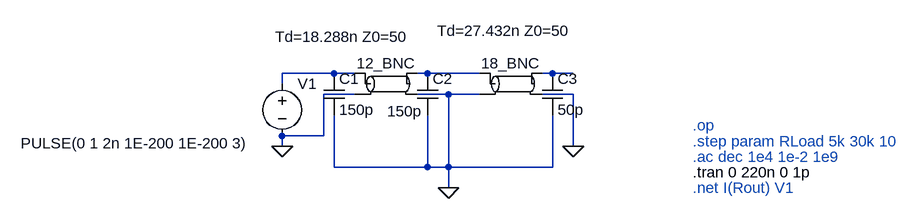
[diagram p0: schematic 2a matched.asc]
2a matched.asc, the LTspice schematic file:
Version 4.1
SHEET 1 1168 680
WIRE 272 432 192 432
WIRE 304 432 272 432
WIRE 416 432 400 432
WIRE 496 432 416 432
WIRE 608 432 592 432
WIRE 640 432 608 432
WIRE 192 448 192 432
WIRE 304 464 256 464
WIRE 448 464 400 464
WIRE 496 464 448 464
WIRE 640 464 592 464
WIRE 256 528 256 464
WIRE 256 528 192 528
WIRE 192 544 192 528
WIRE 640 544 640 464
WIRE 272 576 272 496
WIRE 416 576 416 496
WIRE 416 576 272 576
WIRE 448 576 448 464
WIRE 448 576 416 576
WIRE 608 576 608 496
WIRE 608 576 448 576
WIRE 448 608 448 576
FLAG 448 608 0
FLAG 192 544 0
FLAG 640 544 0
SYMBOL tline 352 448 R0
WINDOW 3 -67 -88 Top 2
SYMATTR InstName 12_BNC
SYMATTR Value Td=18.288n Z0=50
SYMBOL Voltage 192 432 R0
WINDOW 3 -402 107 Left 2
SYMATTR Value PULSE(0 1 2n 1E-200 1E-200 3)
SYMATTR InstName V1
SYMATTR SpiceLine Rser=50
SYMBOL tline 544 448 R0
WINDOW 3 -10 -97 Top 2
SYMATTR InstName 18_BNC
SYMATTR Value Td=27.432n Z0=50
SYMBOL cap 256 432 R0
SYMATTR InstName C1
SYMATTR Value 150p
SYMBOL cap 400 432 R0
WINDOW 3 -46 58 Left 2
SYMATTR InstName C2
SYMATTR Value 150p
SYMBOL cap 592 432 R0
SYMATTR InstName C3
SYMATTR Value 50p
TEXT 824 512 Left 2 ;.op
TEXT 824 536 Left 2 ;.step param RLoad 5k 30k 10
TEXT 824 560 Left 2 ;.ac dec 1e4 1e-2 1e9
TEXT 824 584 Left 2 !.tran 0 220n 0 1p
TEXT 824 608 Left 2 ;.net I(Rout) V1

The netlist it stands for:
* 2a matched.asc
T§12_BNC N001 0 N002 0 Td=18.288n Z0=50
V1 N001 0 PULSE(0 1 2n 1E-200 1E-200 3) Rser=50
T§18_BNC N002 0 N003 0 Td=27.432n Z0=50
C1 N001 0 150p
C2 N002 0 150p
C3 N003 0 50p
* .op
* .step param RLoad 5k 30k 10
* .ac dec 1e4 1e-2 1e9
.tran 0 220n 0 1p
* .net I(Rout) V1
.backanno
.end